# EAGLE design Oda Lambası V0.01 (EAGLE 9.6.2)
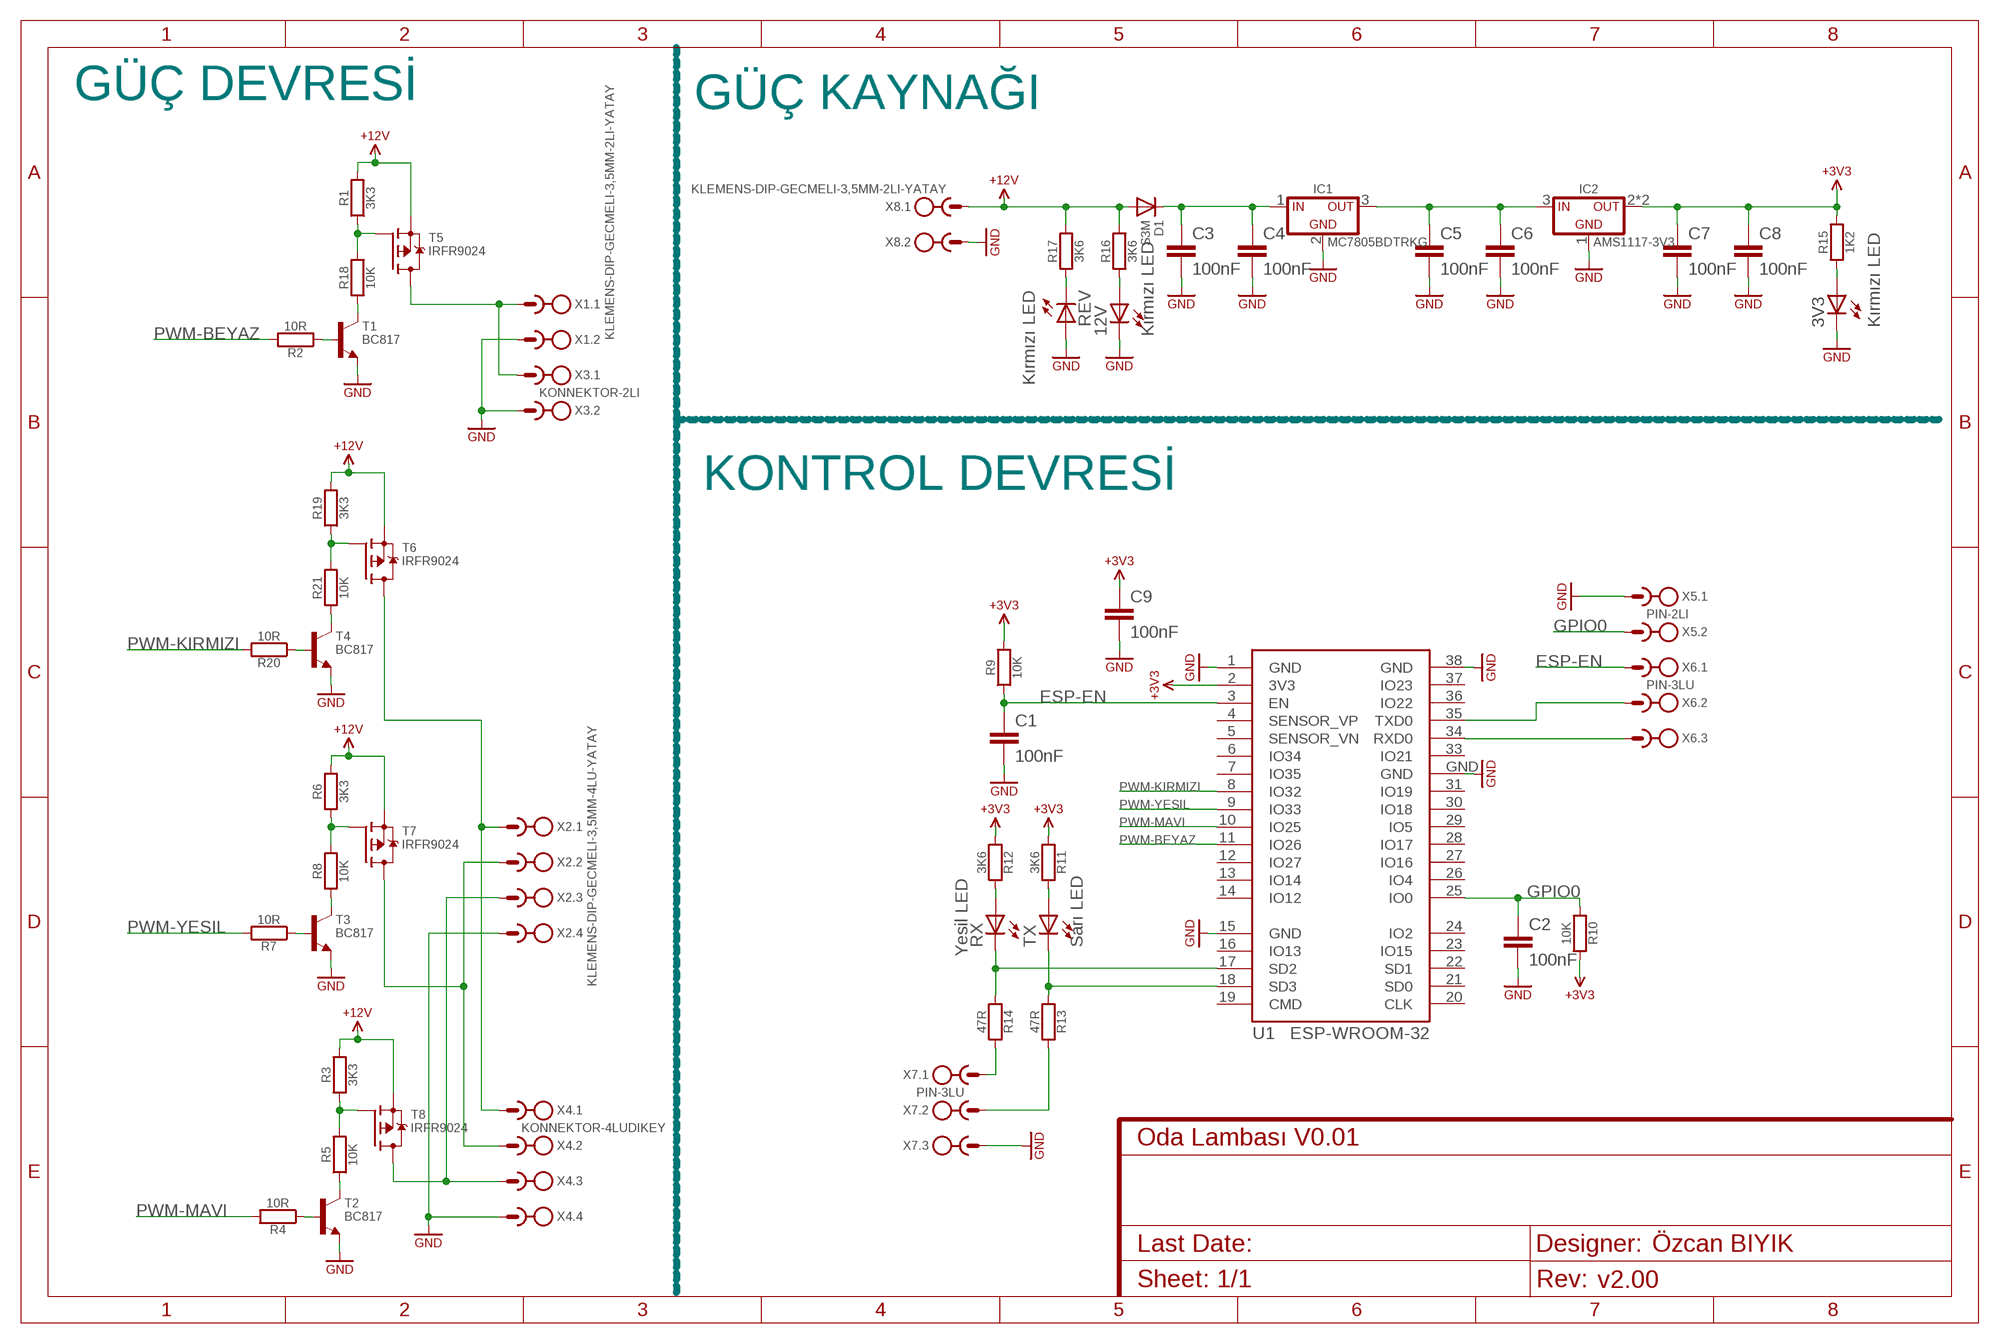
[diagram p0: schematic, sheet 1]
FRAME1 (FRAME-A4L): DESIGNER: Özcan BIYIK; REVNO: v2.00

## Parts
3V3  Kırmızı LED  LED  [0805]
12V  Kırmızı LED  LED  [0805]
C1  100nF  CAP1206  [C1206]
C2  100nF  CAP1206  [C1206]
C3  100nF  CAP1206  [C1206]
C4  100nF  CAP1206  [C1206]
C5  100nF  CAP1206  [C1206]
C6  100nF  CAP1206  [C1206]
C7  100nF  CAP1206  [C1206]
C8  100nF  CAP1206  [C1206]
C9  100nF  CAP1206  [C1206]
D1  S3M  [SMC]
IC1  MC7805BDTRKG  [DPAK]
IC2  AMS1117-3V3  FAN1117A  [SOT223]
R1  3K3  RES1206  [R1206]
R2  10R  RES1206  [R1206]
R3  3K3  RES1206  [R1206]
R4  10R  RES1206  [R1206]
R5  10K  RES1206  [R1206]
R6  3K3  RES1206  [R1206]
R7  10R  RES1206  [R1206]
R8  10K  RES1206  [R1206]
R9  10K  RES1206  [R1206]
R10  10K  RES1206  [R1206]
R11  3K6  RES1206  [R1206]
R12  3K6  RES1206  [R1206]
R13  47R  RES1206  [R1206]
R14  47R  RES1206  [R1206]
R15  1K2  RES1206  [R1206]
R16  3K6  RES1206  [R1206]
R17  3K6  RES1206  [R1206]
R18  10K  RES1206  [R1206]
R19  3K3  RES1206  [R1206]
R20  10R  RES1206  [R1206]
R21  10K  RES1206  [R1206]
REV  Kırmızı LED  LED  [0805]
RX  Yesil LED  LED  [0805]
T1  BC817  [SOT23]
T2  BC817  [SOT23]
T3  BC817  [SOT23]
T4  BC817  [SOT23]
T5  IRFR9024  [DPAK]
T6  IRFR9024  [DPAK]
T7  IRFR9024  [DPAK]
T8  IRFR9024  [DPAK]
TX  Sarı LED  LED  [0805]
U1  ESP-WROOM-32  [ESP-WROOM-32]
X1  KLEMENS-DIP-GECMELI-3,5MM-2LI-YATAY  [KLEMENS-DIP-GECMELI-3,5MM-2LI-YATAY]
X2  KLEMENS-DIP-GECMELI-3,5MM-4LU-YATAY  [KLEMENS-DIP-GECMELI-3,5MM-4LU-YATAY]
X3  KONNEKTOR-2LI  [MOLEX-DIP-2LI-YATAY]
X4  KONNEKTOR-4LUDIKEY  [MOLEX-DIP-4LU-DIKEY]
X5  PIN-2LI  [PINHEADER-DIP-2-2.54]
X6  PIN-3LU  [PINHEADER-DIP-3-2.54]
X7  PIN-3LU  [PINHEADER-DIP-3-2.54]
X8  KLEMENS-DIP-GECMELI-3,5MM-2LI-YATAY  [KLEMENS-DIP-GECMELI-3,5MM-2LI-YATAY]

## Nets
+3V3: C7.1 C8.1 C9.1 IC2.2(OUT) IC2.4(OUT) R9.2 R10.2 R11.2 R12.2 R15.2 U1.2(3V3)
+12V: D1.A R1.2 R3.2 R6.2 R16.2 R17.2 R19.2 T5.3(S) T6.3(S) T7.3(S) T8.3(S) X8.1
ESP-EN: C1.1 R9.1 U1.3(EN) X6.1
GND: 3V3.C 12V.C C1.2 C2.2 C3.2 C4.2 C5.2 C6.2 C7.2 C8.2 C9.2 IC1.2(GND) IC2.1(GND) REV.A T1.2(E) T2.2(E) T3.2(E) T4.2(E) U1.1(GND) U1.15(GND) U1.38(GND) U1.GND X1.2 X2.4 X3.2 X4.4 X5.1 X7.3 X8.2
GPIO0: C2.1 R10.1 U1.25(IO0) X5.2
N$1: R1.1 R18.2 T5.1(G)
N$2: R3.1 R5.2 T8.1(G)
N$3: R5.1 T2.3(C)
N$4: R4.1 T2.1(B)
N$5: T6.2(D) X2.1 X4.1
N$6: T8.2(D) X2.3 X4.3
N$8: T5.2(D) X1.1 X3.1
N$9: U1.35(TXD0) X6.2
N$10: U1.34(RXD0) X6.3
N$11: R18.1 T1.3(C)
N$12: R2.1 T1.1(B)
N$13: R6.1 R8.2 T7.1(G)
N$14: R8.1 T3.3(C)
N$15: R11.1 TX.A
N$16: R12.1 RX.A
N$17: C3.1 C4.1 D1.C IC1.1(IN)
N$18: C5.1 C6.1 IC1.3(OUT) IC2.3(IN)
N$19: R14.1 X7.1
N$20: R13.1 X7.2
N$21: R13.2 TX.C U1.18(SD3)
N$22: R14.2 RX.C U1.17(SD2)
N$23: 3V3.A R15.1
N$24: 12V.A R16.1
N$25: R17.1 REV.C
N$26: R7.1 T3.1(B)
N$27: R19.1 R21.2 T6.1(G)
N$28: R21.1 T4.3(C)
N$29: R20.1 T4.1(B)
N$30: T7.2(D) X2.2 X4.2
PWM-BEYAZ: R2.2 U1.11(IO26)
PWM-KIRMIZI: R20.2 U1.8(IO32)
PWM-MAVI: R4.2 U1.10(IO25)
PWM-YESIL: R7.2 U1.9(IO33)
Unconnected: U1.4(SENSOR_VP) U1.5(SENSOR_VN) U1.6(IO34) U1.7(IO35) U1.12(IO27) U1.13(IO14) U1.14(IO12) U1.16(IO13) U1.19(CMD) U1.20(CLK) U1.21(SD0) U1.22(SD1) U1.23(IO15) U1.24(IO2) U1.26(IO4) U1.27(IO16) U1.28(IO17) U1.29(IO5) U1.30(IO18) U1.31(IO19) U1.33(IO21) U1.36(IO22) U1.37(IO23)

## Notes on the sheet
- GÜÇ DEVRESİ | GÜÇ KAYNAĞI
- KONTROL DEVRESİ

## Library data of the parts
3V3 12V REV RX TX = Ozcan-Led:LED
C1-C9 = Ozcan-RCL:CAP
D1 = Ozcan-Diyot:S3M
IC1 = Ozcan-Regulator:MC7805BDTRKG
IC2 = Ozcan-Regulator:FAN1117A
R1-R21 = Ozcan-RCL:RES
T1-T4 = Ozcan-Transitor:BC817: 45V 500mA
T5-T8 = Ozcan-Mosfet:IRFR9024
U1 = Ozcan-ESP32:ESP-WROOM-32: Espressif Systems ESP-WROOM-32
X1 X8 = Ozcan-Klemens:KLEMENS-DIP-GECMELI-3,5MM-2LI-YATAY
X2 = Ozcan-Klemens:KLEMENS-DIP-GECMELI-3,5MM-4LU-YATAY
X3 = Ozcan-Konnektor:KONNEKTOR-2LI
X4 = Ozcan-Konnektor:KONNEKTOR-4LU
X5 = Ozcan-Konnektor:PIN-2LI
X6 X7 = Ozcan-Konnektor:PIN-3LU

## Board
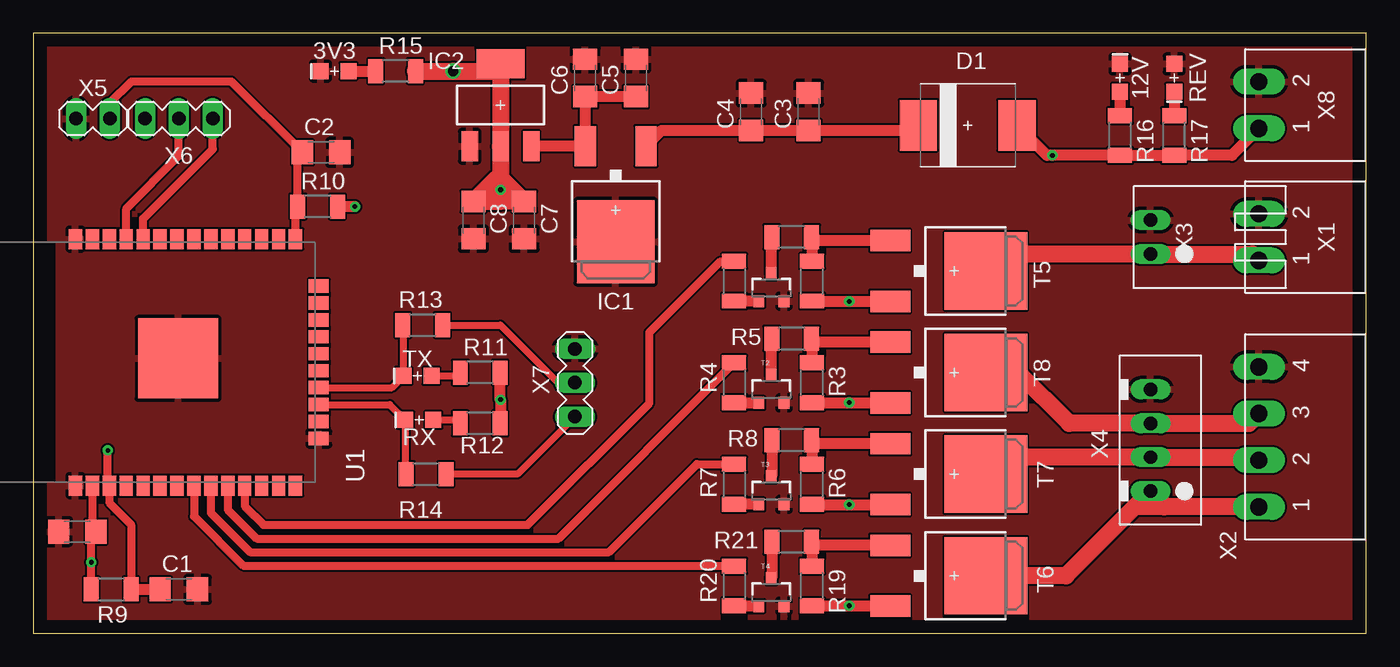
[diagram p1: board, top side]
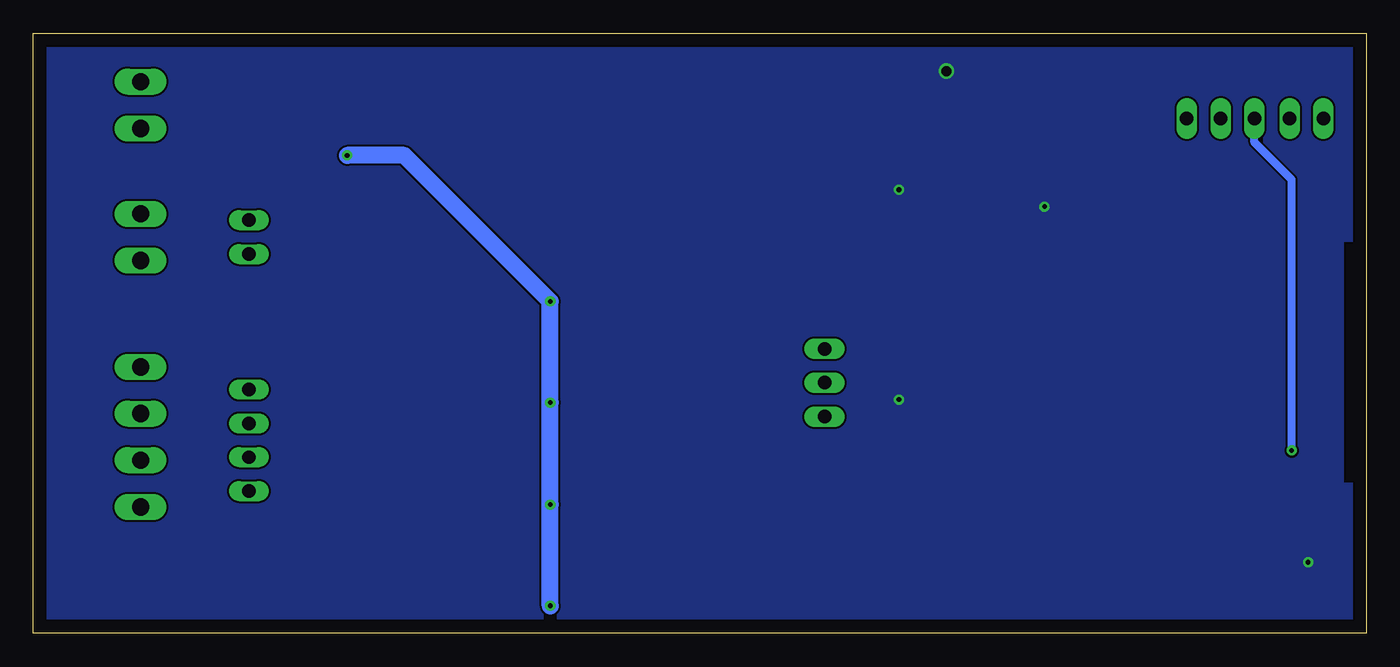
[diagram p2: board, bottom side, seen from below]

Size 100 x 45 mm. Coordinates in mm from the lower left corner, seen from the top.
Outline: 0,0 100,0 100,45 0,45 0,0
Copper layers (1*16): Top 0.035mm / dielectric 1.5mm / Bottom 0.035mm
Design rules "default": minimum track width 6mil, minimum drill 0.35mm, track to track 6mil, track to pad 6mil, pad to pad 6mil, via to via 6mil, smd to smd 6mil, copper to edge 40mil, drill to drill 6mil, minimum pad ring 10mil, minimum via ring 8mil, stop-mask expansion 4mil, vias tented up to drill 0mil, thermal gap 10mil

### Footprints (pad centres in the part's own frame; a part is rotated, then mirrored left to right if it is on the bottom)
0805 = smd 1.2 x 1.2: A 1.05,0; C -1.05,0
C1206 = smd 1.6 x 1.8: 1 -1.4,0; 2 1.4,0
SMC = smd 2.8 x 3.8: A 3.7,0; C -3.7,0
DPAK = smd 3 x 1.6: 1 -4.8,2.28; 3 -4.8,-2.28 | smd 6.2 x 5.8: 2 2.38,0
SOT223 = smd 2.235 x 1.219: 1 3.099,-2.311; 2 3.099,0; 3 3.099,2.311 | smd 2.2 x 3.6: 4 -3.099,0
R1206 = smd 1.12 x 1.8: 1 -1.49,0; 2 1.49,0
SOT23 = smd 0.8 x 0.9: 1 -0.95,-1; 2 0.95,-1; 3 0,1.1
ESP-WROOM-32 = smd 1.5 x 1: 1 -9.25,7; 2 -9.25,5.73; 3 -9.25,4.46; 4 -9.25,3.19; 5 -9.25,1.92; 6 -9.25,0.65; 7 -9.25,-0.62; 8 -9.25,-1.89; 9 -9.25,-3.16; 10 -9.25,-4.43; 11 -9.25,-5.7; 12 -9.25,-6.97; 13 -9.25,-8.24; 14 -9.25,-9.51; 25 9.25,-9.51; 26 9.25,-8.24; 27 9.25,-6.97; 28 9.25,-5.7; 29 9.25,-4.43; 30 9.25,-3.16; 31 9.25,-1.89; 32 9.25,-0.62; 33 9.25,0.65; 34 9.25,1.92; 35 9.25,3.19; 36 9.25,4.46; 37 9.25,5.73; 38 9.25,7 | smd 1 x 1.5: 15 -5.7,-11.25; 16 -4.43,-11.25; 17 -3.16,-11.25; 18 -1.89,-11.25; 19 -0.62,-11.25; 20 0.65,-11.25; 21 1.92,-11.25; 22 3.19,-11.25; 23 4.46,-11.25; 24 5.73,-11.25 | smd 6 x 6: GND 0.3,-0.7
KLEMENS-DIP-GECMELI-3,5MM-2LI-YATAY = drill 1.3 long: 1 -1.75,0; 2 1.75,0
KLEMENS-DIP-GECMELI-3,5MM-4LU-YATAY = drill 1.3 long: 1 -5.25,0; 2 -1.75,0; 3 1.75,0; 4 5.25,0
MOLEX-DIP-2LI-YATAY = drill 1 long: 1 -1.27,0; 2 1.27,0
MOLEX-DIP-4LU-DIKEY = drill 1 long: 1 -3.81,0; 2 -1.27,0; 3 1.27,0; 4 3.81,0
PINHEADER-DIP-2-2.54 = drill 1.016 long: 1 -1.27,0; 2 1.27,0
PINHEADER-DIP-3-2.54 = drill 1.016 long: 1 -2.54,0; 2 0,0; 3 2.54,0

### Placement (x,y rotation side)
3V3  22.61,42.16 0 top
12V  81.53,41.66 270 top
C1  10.92,3.3 0 top
C2  21.59,36.07 0 top
C3  58.17,39.12 90 top
C4  53.85,39.12 90 top
C5  45.21,41.66 90 top
C6  41.4,41.66 90 top
C7  36.83,30.99 270 top
C8  33.02,30.99 270 top
C9  3.3,7.62 180 top
D1  70.1,38.1 0 top
IC1  43.69,31.75 270 top
IC2  35.05,39.62 270 top
R1  58.42,26.42 270 top
R2  52.58,26.42 90 top
R3  58.42,18.8 270 top
R4  52.58,18.8 90 top
R5  56.9,22.1 0 top
R6  58.42,11.18 270 top
R7  52.58,11.18 90 top
R8  56.9,14.48 0 top
R9  5.84,3.3 180 top
R10  21.34,32 0 top
R11  33.53,19.56 0 top
R12  33.53,15.75 0 top
R13  29.21,23.11 180 top
R14  29.46,11.94 180 top
R15  27.18,42.16 0 top
R16  81.53,37.34 270 top
R17  85.6,37.34 270 top
R18  56.9,29.72 0 top
R19  58.42,3.56 270 top
R20  52.58,3.56 90 top
R21  56.9,6.86 0 top
REV  85.6,41.66 90 top
RX  28.96,16 0 top
T1  55.37,25.91 0 top
T2  55.37,18.29 0 top
T3  55.37,10.67 0 top
T4  55.37,3.05 0 top
T5  69.09,27.18 0 top
T6  69.09,4.32 0 top
T7  69.09,11.94 0 top
T8  69.09,19.56 0 top
TX  28.83,19.3 0 top
U1  10.16,20.32 90 top
X1  91.95,29.72 90 top
X2  91.95,14.73 90 top
X3  83.82,29.72 90 top
X4  83.82,14.48 90 top
X5  4.47,38.61 0 top
X6  10.92,38.61 0 top
X7  40.64,18.8 90 top
X8  91.95,39.62 90 top

### Tracks (layer width: path | path; a pad name or v marks a point on that pad's centre or on a via)
+3V3  (via drill 0.35, 0.75)
  Top 0.61: U1.2 4.43,7.89 C9.1 4.35,7.27 v4.35,5.33 R9.2
  Top 0.813: v24.13,32 R10.2 | R11.2 35.02,17.56 v35.05,17.53 35.05,15.78 R12.2
  Top 1.27: R15.2 v31.5,42.16 34.49,42.16 IC2.4 IC2.2 35.05,34.17 | 35.05,34.17 C7.1 35.05,32.39 | 35.05,32.39 C8.1 34.8,34.17 | 35.05,34.17 34.8,34.17 | 34.8,34.17 35.05,33.91 v35.05,33.27 35.05,32.39
  pour Bottom: 0.25,44.7 99.82,44.7 99.82,0.25 0.25,0.25 0.25,44.45
+12V  (via drill 0.35)
  Top 0.813: D1.A 76.06,35.85 v76.45,35.85 R16.2 R17.2 89.92,35.85 X8.1 | R1.2 58.45,24.9 v61.21,24.9 T5.3 | R3.2 v61.21,17.31 64.26,17.31 T8.3 | R6.2 58.45,9.66 v61.21,9.66 T7.3 | R19.2 v61.21,2.07 64.26,2.07 T6.3
  Bottom 1.27: v61.21,2.07 v61.21,9.66 v61.21,17.31 v61.21,24.9 72.16,35.85 v76.45,35.85
ESP-EN  (via drill 0.35)
  Top 0.61: R9.1 7.33,8.16 5.7,9.79 U1.3 5.59,11.18 v5.59,13.72
  Top 0.813: R9.1 C1.1
  Bottom 0.61: v5.59,13.72 5.59,34.04 8.38,36.83 X6.1
GND
  pour Top: 0.51,44.7 99.82,44.7 99.82,0.25 0.25,0.25 0.25,44.7
GPIO0
  Top 0.61: U1.25 19.67,31.83 R10.1 19.85,35.72 C2.1 14.86,41.4 7.37,41.4 5.74,39.78 X5.2
N$1
  Top 0.813: R18.2 58.42,29.68 | 58.42,29.68 R1.1 | T5.1 58.65,29.46 58.42,29.68
N$2
  Top 0.813: R5.2 58.42,22.06 | 58.42,22.06 R3.1 | T8.1 58.65,21.84 58.42,22.06
N$3
  Top 0.813: T2.3 55.37,22.06 R5.1
N$4
  Top 0.813: R4.1 54.4,17.31 T2.1
N$5
  Top 1.27: 82.63,9.48 X4.1 84.84,9.65 84.84,9.48 | 82.63,9.48 77.47,4.32 T6.2 | X2.1 84.84,9.48 | 84.84,9.48 82.63,9.48
N$6
  Top 1.27: T8.2 73.91,19.56 77.72,15.75 X4.3 91.21,15.75 X2.3
N$8
  Top 1.27: T5.2 72.74,28.45 X3.1 91.47,28.45 X1.1
N$9
  Top 0.61: U1.35 6.97,31.86 10.92,35.81 X6.2
N$10
  Top 0.61: U1.34 8.24,31.1 13.46,36.32 X6.3
N$11
  Top 0.813: T1.3 55.37,29.68 R18.1
N$12
  Top 0.813: R2.1 54.4,24.93 T1.1
N$13
  Top 0.813: R6.1 58.42,14.44 R8.2 58.65,14.22 T7.1
N$14
  Top 0.813: R8.1 55.41,11.8 T3.3
N$15
  Top 0.508: TX.A 31.78,19.3 R11.1
N$16
  Top 0.508: RX.A 31.78,16 R12.1
N$17
  Top 0.813: IC1.1 47.13,37.72 C4.1 C3.1 66.02,37.72 D1.C
N$18
  Top 0.813: C6.1 | C6.1 IC1.3 37.39,36.55 IC2.3 | C5.1 41.41,40.26 C6.1
N$19
  Top 0.508: X7.1 36.32,11.94 R14.1
N$20
  Top 0.508: R13.1 35.05,23.11 39.37,18.8 X7.2
N$21
  Top 0.508: U1.18 26.91,18.43 TX.C 27.78,23.05 R13.2
N$22
  Top 0.508: U1.17 26.75,17.16 RX.C 27.91,12.01 R14.2
N$23
  Top 0.813: 3V3.A R15.1
N$24
  Top 0.813: 12V.A R16.1
N$25
  Top 0.813: REV.C R17.1
N$26
  Top 0.813: T3.1 52.6,9.67 R7.1
N$27
  Top 0.813: T6.1 58.65,6.6 R21.2 58.42,6.82 R19.1
N$28
  Top 0.813: R21.1 55.41,4.18 T4.3
N$29
  Top 0.813: T4.1 52.6,2.05 R20.1
N$30
  Top 1.27: T7.2 72.74,13.21 X4.2 91.72,13.21 X2.2
PWM-BEYAZ
  Top 0.61: U1.11 15.86,9.54 17.27,8.13 37.08,8.13 46.23,17.27 46.23,22.57 51.56,27.91 R2.2
PWM-KIRMIZI
  Top 0.61: U1.8 12.05,8.78 15.75,5.08 52.54,5.08 R20.2
PWM-MAVI
  Top 0.61: U1.10 14.59,9.29 16.76,7.11 39.4,7.11 R4.2
PWM-YESIL
  Top 0.61: U1.9 13.32,9.03 16.26,6.1 43.18,6.1 49.78,12.7 52.54,12.7 R7.2